# Altium schematic sheet Monostable Clock.schdoc
size 112 x 56 mm
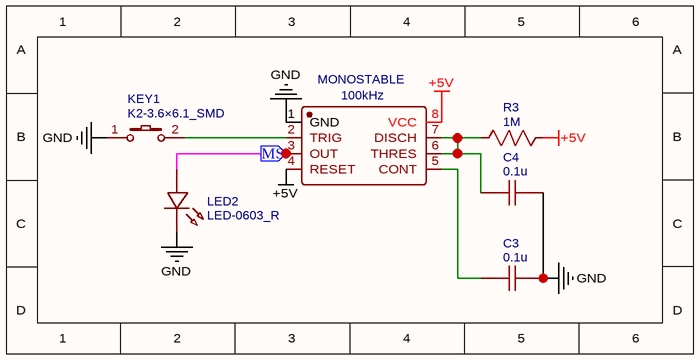
[diagram p0: Monostable Clock.schdoc]

## Parts
C3  0.1u  [C0603]
C4  0.1u  [C0603]
KEY1  K2-3.6×6.1_SMD  [KEY-SMD_2P-L6.2-W3.6-LS8.0]
LED2  LED-0603_R  [LED0603_RED]
MONOSTABLE  100kHz  [SO-8_L4.9-W3.9-P1.27-LS5.9-BL]
R3  1M  [R0603]

## Ports
MS (in)

## Nets
+5V: MONOSTABLE.4(RESET) MONOSTABLE.8(VCC) R3.2
GND: C3.2 C4.2 KEY1.1 LED2.2 MONOSTABLE.1(GND)
MS: LED2.1 MONOSTABLE.3(OUT) ; port MS
NetC3_1: C3.1 MONOSTABLE.5(CONT)
NetC4_1: C4.1 MONOSTABLE.6(THRES) MONOSTABLE.7(DISCH) R3.1
NetKEY1_2: KEY1.2 MONOSTABLE.2(TRIG)

## Library data of the parts
C3 C4 = 0.1u: nameAlias: Value(F); Contributor: LCEDA_Lib; spicePre: C; spiceSymbolName: C_0603_US
KEY1 = K2-3.6×6.1_SMD: Manufacturer Part: K2-1107ST-A4SW-06; Contributor: LCEDA_Lib; 制造商: 韩国韩荣; Supplier Part: C118141; Supplier: LCSC; spicePre: K; spiceSymbolName: K2-3.6×6.1_SMD
LED2 = LED-0603_R: Manufacturer: EVERLIGHT(台湾亿光); Manufacturer Part: 19-217/R6C-AL1M2VY/3T; Contributor: LCEDA_01; Supplier Part: C72044; Supplier: LCSC; spicePre: L; spiceSymbolName: LED-0603_R
MONOSTABLE = 100kHz: Manufacturer: TI(德州仪器); Manufacturer Part: NE555PSRE4; Contributor: lcsc; nameAlias: Value; Supplier: LCSC; Supplier Part: C2666911; spicePre: U; spiceSymbolName: NE555PSRE4
R3 = 1M: nameAlias: Value(Ω); Contributor: LCEDA_Lib; spicePre: R; spiceSymbolName: R_0603_US